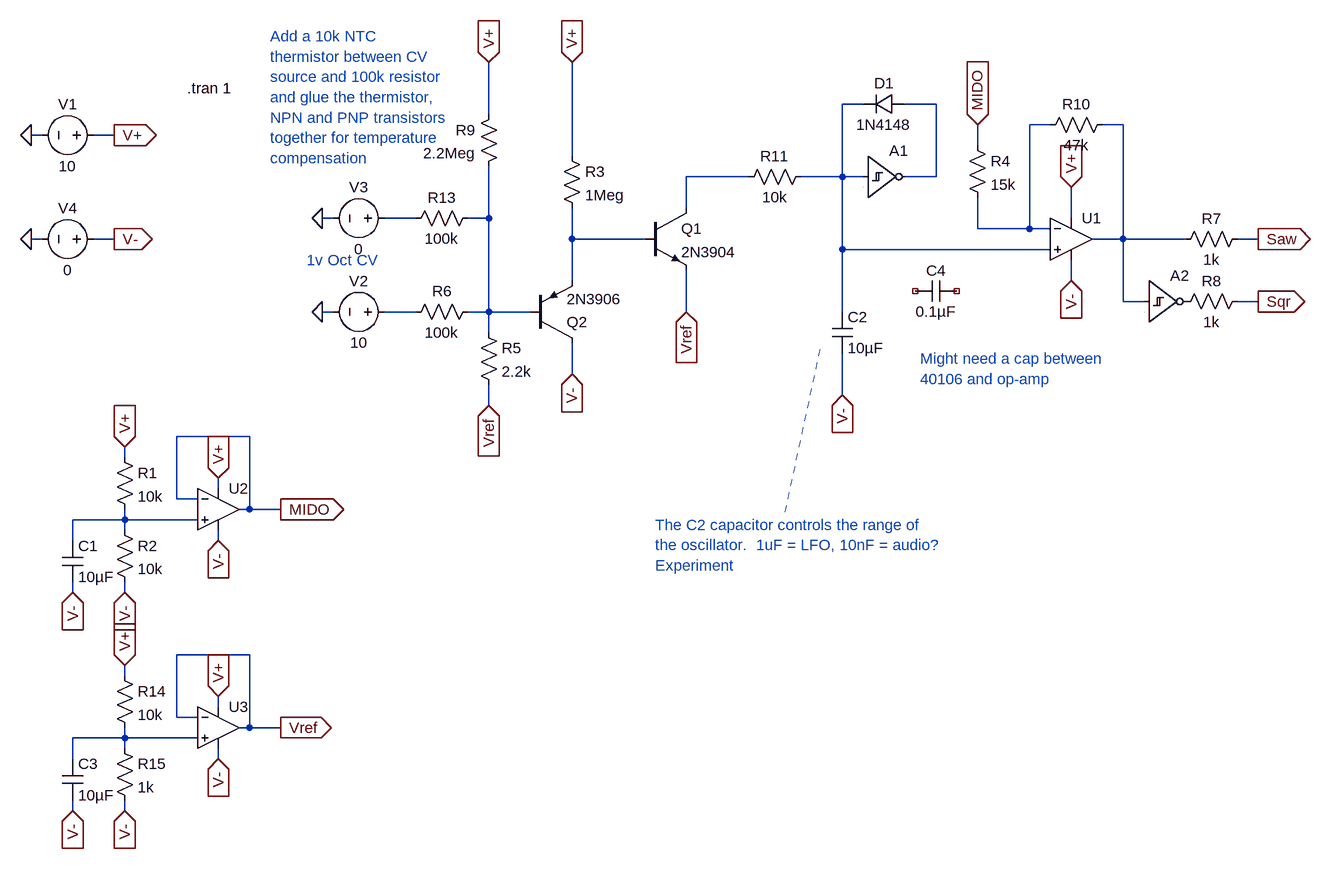
[diagram p0: schematic 001_1v_Oct_40106_simple.asc]
001_1v_Oct_40106_simple.asc, the LTspice schematic file:
Version 4
SHEET 1 1732 784
WIRE 528 -448 496 -448
WIRE 640 -448 592 -448
WIRE -48 -432 -48 -512
WIRE 816 -416 784 -416
WIRE 928 -416 896 -416
WIRE -736 -400 -752 -400
WIRE -624 -400 -656 -400
WIRE 704 -384 704 -416
WIRE 80 -368 80 -512
WIRE 352 -336 256 -336
WIRE 496 -336 496 -448
WIRE 496 -336 432 -336
WIRE 528 -336 496 -336
WIRE 640 -336 640 -448
WIRE 640 -336 592 -336
WIRE 256 -288 256 -336
WIRE -288 -272 -304 -272
WIRE -160 -272 -208 -272
WIRE -48 -272 -48 -352
WIRE -48 -272 -80 -272
WIRE 848 -272 848 -320
WIRE 704 -256 704 -304
WIRE 784 -256 784 -416
WIRE 784 -256 704 -256
WIRE 816 -256 784 -256
WIRE -736 -240 -752 -240
WIRE -624 -240 -656 -240
WIRE 80 -240 80 -288
WIRE 192 -240 80 -240
WIRE 928 -240 928 -416
WIRE 928 -240 880 -240
WIRE 1024 -240 928 -240
WIRE 1136 -240 1104 -240
WIRE 496 -224 496 -336
WIRE 816 -224 496 -224
WIRE 80 -176 80 -240
WIRE 848 -176 848 -208
WIRE 928 -144 928 -240
WIRE 960 -144 928 -144
WIRE 1136 -144 1104 -144
WIRE -288 -128 -304 -128
WIRE -160 -128 -208 -128
WIRE -48 -128 -48 -272
WIRE -48 -128 -80 -128
WIRE 16 -128 -48 -128
WIRE 256 -128 256 -192
WIRE 496 -128 496 -224
WIRE -48 -96 -48 -128
WIRE 80 -32 80 -80
WIRE 496 0 496 -64
WIRE -48 16 -48 -16
WIRE -416 64 -528 64
WIRE -608 96 -608 80
WIRE -464 144 -464 128
WIRE -528 160 -528 64
WIRE -496 160 -528 160
WIRE -416 176 -416 64
WIRE -416 176 -432 176
WIRE -368 176 -416 176
WIRE -608 192 -608 176
WIRE -608 192 -688 192
WIRE -496 192 -608 192
WIRE -608 208 -608 192
WIRE -688 224 -688 192
WIRE -464 224 -464 208
WIRE -688 304 -688 288
WIRE -608 304 -608 288
WIRE -416 400 -528 400
WIRE -608 432 -608 416
WIRE -464 480 -464 464
WIRE -528 496 -528 400
WIRE -496 496 -528 496
WIRE -416 512 -416 400
WIRE -416 512 -432 512
WIRE -368 512 -416 512
WIRE -608 528 -608 512
WIRE -608 528 -688 528
WIRE -496 528 -608 528
WIRE -608 544 -608 528
WIRE -688 560 -688 528
WIRE -464 560 -464 544
WIRE -688 640 -688 624
WIRE -608 640 -608 624
FLAG 80 -512 V+
IOPIN 80 -512 In
FLAG -304 -128 0
FLAG 496 0 V-
IOPIN 496 0 In
FLAG -48 16 Vref
IOPIN -48 16 In
FLAG 256 -128 Vref
IOPIN 256 -128 In
FLAG 80 -32 V-
IOPIN 80 -32 In
FLAG 848 -320 V+
IOPIN 848 -320 In
FLAG 848 -176 V-
IOPIN 848 -176 In
FLAG 1136 -240 Saw
IOPIN 1136 -240 Out
FLAG 1136 -144 Sqr
IOPIN 1136 -144 Out
FLAG -48 -512 V+
IOPIN -48 -512 In
FLAG -304 -272 0
FLAG -624 -400 V+
IOPIN -624 -400 Out
FLAG -624 -240 V-
IOPIN -624 -240 Out
FLAG -752 -400 0
FLAG -752 -240 0
FLAG -608 304 V-
IOPIN -608 304 In
FLAG -608 80 V+
IOPIN -608 80 In
FLAG -688 304 V-
IOPIN -688 304 In
FLAG -464 128 V+
IOPIN -464 128 In
FLAG -464 224 V-
IOPIN -464 224 In
FLAG -368 176 MIDO
IOPIN -368 176 Out
FLAG -608 640 V-
IOPIN -608 640 In
FLAG -608 416 V+
IOPIN -608 416 In
FLAG -688 640 V-
IOPIN -688 640 In
FLAG -464 464 V+
IOPIN -464 464 In
FLAG -464 560 V-
IOPIN -464 560 In
FLAG -368 512 Vref
IOPIN -368 512 Out
FLAG 704 -416 MIDO
IOPIN 704 -416 In
SYMBOL npn 192 -288 R0
SYMATTR InstName Q1
SYMATTR Value 2N3904
SYMBOL pnp 16 -80 M180
SYMATTR InstName Q2
SYMATTR Value 2N3906
SYMBOL res 64 -384 R0
SYMATTR InstName R3
SYMATTR Value 1Meg
SYMBOL res -64 -112 R0
SYMATTR InstName R5
SYMATTR Value 2.2k
SYMBOL res -64 -144 R90
WINDOW 0 0 56 VBottom 2
WINDOW 3 32 56 VTop 2
SYMATTR InstName R6
SYMATTR Value 100k
SYMBOL voltage -192 -128 R90
WINDOW 0 -32 56 VBottom 2
WINDOW 3 32 56 VTop 2
SYMATTR InstName V2
SYMATTR Value 10
SYMBOL Digital/schmtinv 528 -400 R0
SYMATTR InstName A1
SYMATTR SpiceLine VHigh=10 Vt=4.9 Vh=1.0 Trise=.0001 Tfall=.0001
SYMBOL cap 480 -128 R0
SYMATTR InstName C2
SYMATTR Value 10µF
SYMBOL diode 592 -464 R90
WINDOW 0 0 32 VBottom 2
WINDOW 3 32 32 VTop 2
SYMATTR InstName D1
SYMATTR Value 1N4148
SYMBOL res -32 -448 M0
SYMATTR InstName R9
SYMATTR Value 2.2Meg
SYMBOL Opamps/UniversalOpamp2 848 -240 R0
SYMATTR InstName U1
SYMBOL Digital/schmtinv 960 -208 R0
SYMATTR InstName A2
SYMATTR SpiceLine VHigh=10 Vt=4.9 Vh=1.0 Trise=0.00001 Tfall=0.00001
SYMBOL res 1120 -256 R90
WINDOW 0 0 56 VBottom 2
WINDOW 3 32 56 VTop 2
SYMATTR InstName R7
SYMATTR Value 1k
SYMBOL res 1120 -160 R90
WINDOW 0 0 56 VBottom 2
WINDOW 3 32 56 VTop 2
SYMATTR InstName R8
SYMATTR Value 1k
SYMBOL res 912 -432 R90
WINDOW 0 0 56 VBottom 2
WINDOW 3 32 56 VTop 2
SYMATTR InstName R10
SYMATTR Value 47k
SYMBOL res -64 -288 R90
WINDOW 0 0 56 VBottom 2
WINDOW 3 32 56 VTop 2
SYMATTR InstName R13
SYMATTR Value 100k
SYMBOL voltage -192 -272 R90
WINDOW 0 -32 56 VBottom 2
WINDOW 3 32 56 VTop 2
SYMATTR InstName V3
SYMATTR Value 0
SYMBOL res -624 80 R0
SYMATTR InstName R1
SYMATTR Value 10k
SYMBOL res -624 192 R0
SYMATTR InstName R2
SYMATTR Value 10k
SYMBOL cap -704 224 R0
SYMATTR InstName C1
SYMATTR Value 10µF
SYMBOL voltage -640 -400 R90
WINDOW 0 -32 56 VBottom 2
WINDOW 3 32 56 VTop 2
SYMATTR InstName V1
SYMATTR Value 10
SYMBOL voltage -640 -240 R90
WINDOW 0 -32 56 VBottom 2
WINDOW 3 32 56 VTop 2
SYMATTR InstName V4
SYMATTR Value 0
SYMBOL Opamps/UniversalOpamp2 -464 176 R0
SYMATTR InstName U2
SYMBOL res -624 416 R0
SYMATTR InstName R14
SYMATTR Value 10k
SYMBOL res -624 528 R0
SYMATTR InstName R15
SYMATTR Value 1k
SYMBOL cap -704 560 R0
SYMATTR InstName C3
SYMATTR Value 10µF
SYMBOL Opamps/UniversalOpamp2 -464 512 R0
SYMATTR InstName U3
SYMBOL res 448 -352 R90
WINDOW 0 0 56 VBottom 2
WINDOW 3 32 56 VTop 2
SYMATTR InstName R11
SYMATTR Value 10k
SYMBOL cap 672 -176 R90
WINDOW 0 0 32 VBottom 2
WINDOW 3 32 32 VTop 2
SYMATTR InstName C4
SYMATTR Value 0.1µF
SYMBOL res 688 -400 R0
SYMATTR InstName R4
SYMATTR Value 15k
TEXT -512 -472 Left 2 !.tran 1
TEXT -328 -208 Left 2 ;1v Oct CV
TEXT 208 200 Left 2 ;The C2 capacitor controls the range of\nthe oscillator.  1uF = LFO, 10nF = audio?\nExperiment
TEXT 616 -56 Left 2 ;Might need a cap between \n40106 and op-amp
TEXT -384 -552 Left 2 ;Add a 10k NTC\nthermistor between CV \nsource and 100k resistor\nand glue the thermistor, \nNPN and PNP transistors \ntogether for temperature\ncompensation
LINE Normal 408 180 464 -80 2

The netlist it stands for:
* 001_1v_Oct_40106_simple.asc
Q1 N005 N008 Vref 0 2N3904
Q2 V- N007 N008 0 2N3906
R3 V+ N008 1Meg
R5 N007 Vref 2.2k
R6 N007 N009 100k
V2 N009 0 10
A1 N001 0 0 0 0 N002 0 0 SCHMITT VHigh=10 Vt=4.9 Vh=1.0 Trise=.0001 Tfall=.0001
C2 N001 V- 10µF
D1 N002 N001 1N4148
R9 V+ N007 2.2Meg
XU1 N001 N003 V+ V- N004 level.2 Avol=1Meg GBW=10Meg Slew=10Meg ilimit=25m rail=0 Vos=0 phimargin=45 en=0 enk=0 in=0 ink=0 Rin=500Meg  ; pins IN+ IN- V+ V- OUT
A2 N004 0 0 0 0 P001 0 0 SCHMITT VHigh=10 Vt=4.9 Vh=1.0 Trise=0.00001 Tfall=0.00001
R7 Saw N004 1k
R8 Sqr P001 1k
R10 N004 N003 47k
R13 N007 N006 100k
V3 N006 0 0
R1 V+ N010 10k
R2 N010 V- 10k
C1 N010 V- 10µF
V1 V+ 0 10
V4 V- 0 0
XU2 N010 MIDO V+ V- MIDO level.2 Avol=1Meg GBW=10Meg Slew=10Meg ilimit=25m rail=0 Vos=0 phimargin=45 en=0 enk=0 in=0 ink=0 Rin=500Meg  ; pins IN+ IN- V+ V- OUT
R14 V+ N011 10k
R15 N011 V- 1k
C3 N011 V- 10µF
XU3 N011 Vref V+ V- Vref level.2 Avol=1Meg GBW=10Meg Slew=10Meg ilimit=25m rail=0 Vos=0 phimargin=45 en=0 enk=0 in=0 ink=0 Rin=500Meg  ; pins IN+ IN- V+ V- OUT
R11 N001 N005 10k
C4 NC_01 NC_02 0.1µF
R4 MIDO N003 15k
.model D D
.lib standard.dio
.model NPN NPN
.model PNP PNP
.lib standard.bjt
.tran 1
* 1v Oct CV
* The C2 capacitor controls the range of
* the oscillator.  1uF = LFO, 10nF = audio?
* Experiment
* Might need a cap between
* 40106 and op-amp
* Add a 10k NTC
* thermistor between CV
* source and 100k resistor
* and glue the thermistor,
* NPN and PNP transistors
* together for temperature
* compensation
.lib UniversalOpamps2.sub
.backanno
.end